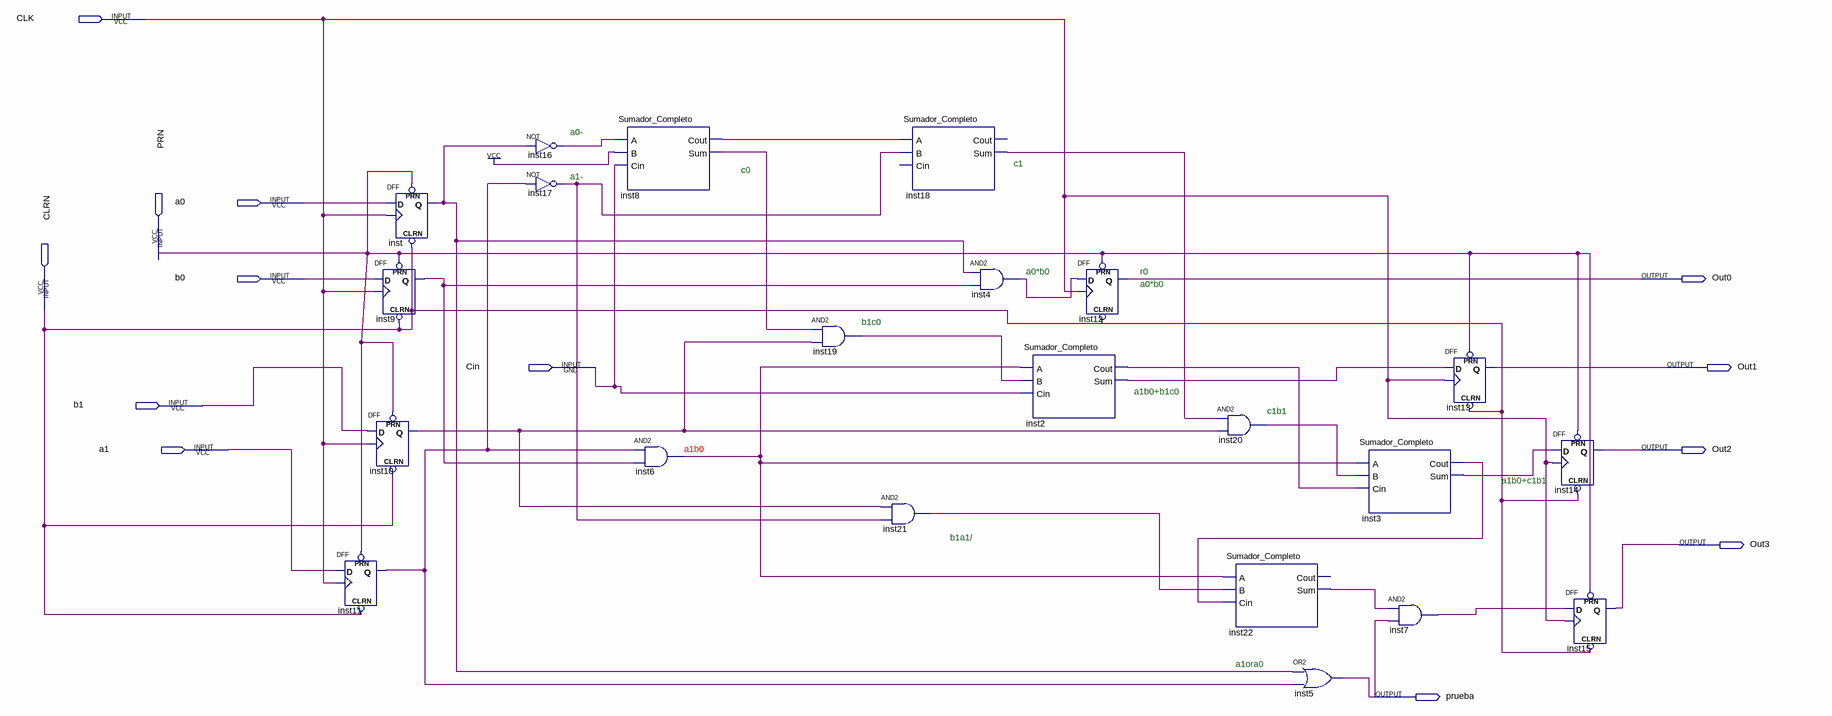
[diagram p0: schematic sheet]
// Quartus schematic multi2consigno.bdf as structural Verilog: 22 symbols, 13 pins
module multi2consigno (
  input  CLK,
  input  a0,
  input  PRN,
  input  b0,
  input  CLRN,
  input  Cin,
  input  b1,
  input  a1,
  output Out0,
  output Out1,
  output Out2,
  output Out3,
  output prueba
);

  wire inst2_cout, inst2_sum, inst3_cout, inst3_sum, inst4_out, inst6_out, inst7_out, inst8_cout, inst8_sum,
       inst9_q, inst10_q, inst11_q, inst16_out, inst17_out, inst18_sum, inst19_out, inst20_out, inst21_out,
       inst22_sum, inst_q;

  DFF inst11 (.CLRN(CLRN), .CLK(CLK), .D(a1), .PRN(PRN), .Q(inst11_q));
  DFF inst (.CLRN(CLRN), .CLK(CLK), .D(a0), .PRN(PRN), .Q(inst_q));
  DFF inst9 (.CLRN(CLRN), .CLK(CLK), .D(b0), .PRN(PRN), .Q(inst9_q));
  DFF inst10 (.CLRN(CLRN), .CLK(CLK), .D(b1), .PRN(PRN), .Q(inst10_q));
  not inst16 (inst16_out, inst_q);
  not inst17 (inst17_out, inst11_q);
  Sumador_Completo inst8 (.A(inst16_out), .B(1'b1), .Cin(Cin), .Cout(inst8_cout), .Sum(inst8_sum));
  and inst6 (inst6_out, inst11_q, inst9_q);
  and inst19 (inst19_out, inst8_sum, inst10_q);
  Sumador_Completo inst18 (.A(inst8_cout), .B(inst17_out), .Sum(inst18_sum));  // open: Cin, Cout
  and inst21 (inst21_out, inst10_q, inst17_out);
  and inst4 (inst4_out, inst_q, inst9_q);
  Sumador_Completo inst2 (.A(inst6_out), .B(inst19_out), .Cin(Cin), .Cout(inst2_cout), .Sum(inst2_sum));
  DFF inst12 (.CLRN(CLRN), .CLK(CLK), .D(inst4_out), .PRN(PRN), .Q(Out0));
  and inst20 (inst20_out, inst18_sum, inst10_q);
  Sumador_Completo inst22 (.A(inst6_out), .B(inst21_out), .Cin(inst3_cout), .Sum(inst22_sum));  // open: Cout
  or inst5 (prueba, inst_q, inst11_q);
  Sumador_Completo inst3 (.A(inst6_out), .B(inst20_out), .Cin(inst2_cout), .Cout(inst3_cout), .Sum(inst3_sum));
  and inst7 (inst7_out, inst22_sum, prueba);
  DFF inst13 (.CLRN(CLRN), .CLK(CLK), .D(inst2_sum), .PRN(PRN), .Q(Out1));
  DFF inst14 (.CLRN(CLRN), .CLK(CLK), .D(inst3_sum), .PRN(PRN), .Q(Out2));
  DFF inst15 (.CLRN(CLRN), .CLK(CLK), .D(inst7_out), .PRN(PRN), .Q(Out3));

  // Notes on the sheet:
  //   a0-
  //   c1
  //   c0
  //   a1-
  //   a0*b0
  //   r0
  //   a0*b0
  //   b1c0
  //   a1b0+b1c0
  //   c1b1
  //   a1b0
  //   a1b0+c1b1
  //   b1a1/
  //   a1ora0
endmodule
